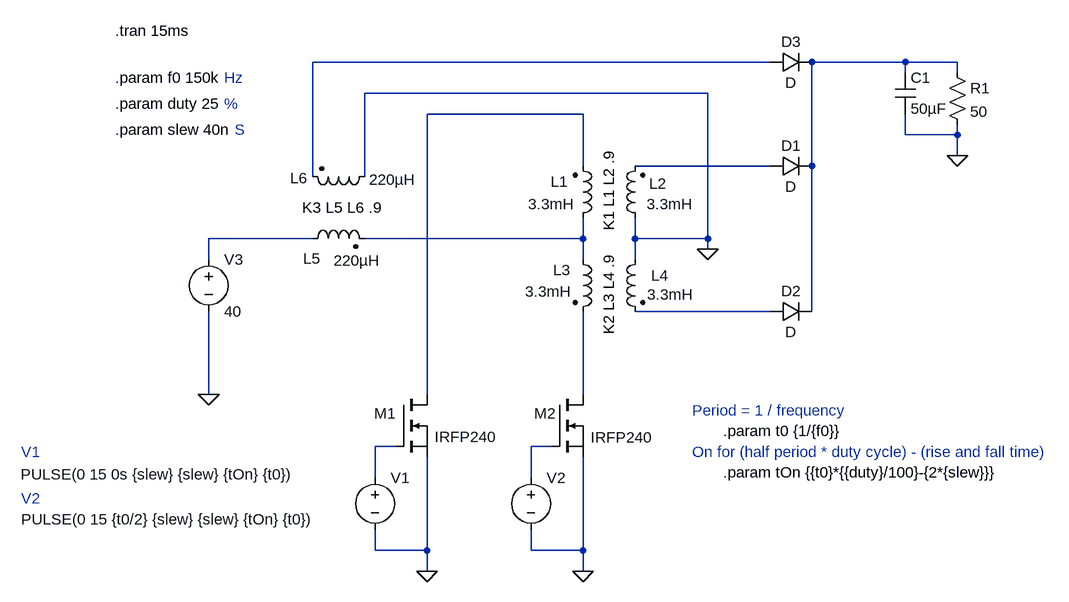
[diagram p0: schematic v03-NonIdeal.asc]
v03-NonIdeal.asc, the LTspice schematic file:
Version 4
SHEET 1 1008 1016
WIRE 448 32 -256 32
WIRE 656 32 512 32
WIRE 736 32 656 32
WIRE 656 48 656 32
WIRE 736 48 736 32
WIRE 352 80 -176 80
WIRE 160 112 -80 112
WIRE 656 144 656 112
WIRE 736 144 736 128
WIRE 736 144 656 144
WIRE 736 176 736 144
WIRE 160 192 160 112
WIRE 448 192 240 192
WIRE 512 192 512 32
WIRE -256 208 -256 32
WIRE -176 208 -176 80
WIRE -256 304 -416 304
WIRE 160 304 160 272
WIRE 160 304 -176 304
WIRE 240 304 240 272
WIRE 352 304 352 80
WIRE 352 304 240 304
WIRE 352 320 352 304
WIRE -416 336 -416 304
WIRE 160 336 160 304
WIRE 240 336 240 304
WIRE 448 416 240 416
WIRE 512 416 512 192
WIRE -416 544 -416 416
WIRE -80 544 -80 112
WIRE 160 544 160 416
WIRE -128 624 -160 624
WIRE 112 624 80 624
WIRE -160 672 -160 624
WIRE 80 672 80 624
WIRE -160 784 -160 752
WIRE -80 784 -80 640
WIRE -80 784 -160 784
WIRE 80 784 80 752
WIRE 160 784 160 640
WIRE 160 784 80 784
WIRE -80 816 -80 784
WIRE 160 816 160 784
FLAG -80 816 0
FLAG 160 816 0
FLAG 736 176 0
FLAG -416 544 0
FLAG 352 320 0
SYMBOL ind2 144 288 M180
WINDOW 0 -34 72 Left 2
WINDOW 3 -68 37 Left 2
SYMATTR InstName L1
SYMATTR Value 3.3mH
SYMATTR Type ind
SYMATTR SpiceLine Rser=0.32
SYMBOL ind2 256 288 R180
WINDOW 0 -33 69 Left 2
WINDOW 3 -73 37 Left 2
SYMATTR InstName L2
SYMATTR Value 3.3mH
SYMATTR Type ind
SYMATTR SpiceLine Rser=0.32
SYMBOL ind2 144 320 R0
WINDOW 0 -30 32 Left 2
WINDOW 3 -73 65 Left 2
SYMATTR InstName L3
SYMATTR Value 3.3mH
SYMATTR Type ind
SYMATTR SpiceLine Rser=0.32
SYMBOL ind2 256 320 M0
WINDOW 0 -36 41 Left 2
WINDOW 3 -74 70 Left 2
SYMATTR InstName L4
SYMATTR Value 3.3mH
SYMATTR Type ind
SYMATTR SpiceLine Rser=0.32
SYMBOL ind2 -272 320 R270
WINDOW 0 -30 15 VTop 2
WINDOW 3 -2 84 VBottom 2
SYMATTR InstName L5
SYMATTR Value 220µH
SYMATTR Type ind
SYMATTR SpiceLine Rser=0.32
SYMBOL ind2 -160 192 R90
WINDOW 0 34 117 VBottom 2
WINDOW 3 5 -27 VTop 2
SYMATTR InstName L6
SYMATTR Value 220µH
SYMATTR Type ind
SYMATTR SpiceLine Rser=0.32
SYMBOL nmos -128 544 R0
WINDOW 0 -33 29 Left 2
WINDOW 3 60 65 Left 2
SYMATTR InstName M1
SYMATTR Value IRFP240
SYMBOL nmos 112 544 R0
WINDOW 0 -27 29 Left 2
WINDOW 3 60 66 Left 2
SYMATTR InstName M2
SYMATTR Value IRFP240
SYMBOL diode 448 208 R270
WINDOW 0 32 32 VTop 2
WINDOW 3 0 32 VBottom 2
SYMATTR InstName D1
SYMBOL diode 448 432 R270
WINDOW 0 32 32 VTop 2
WINDOW 3 0 32 VBottom 2
SYMATTR InstName D2
SYMBOL diode 448 48 R270
WINDOW 0 32 32 VTop 2
WINDOW 3 0 32 VBottom 2
SYMATTR InstName D3
SYMBOL voltage -160 656 R0
WINDOW 3 -545 11 Left 2
WINDOW 123 0 0 Left 2
WINDOW 39 0 0 Left 2
SYMATTR Value PULSE(0 15 0s {slew} {slew} {tOn} {t0})
SYMATTR InstName V1
SYMBOL voltage 80 656 R0
WINDOW 123 0 0 Left 2
WINDOW 39 0 0 Left 2
WINDOW 3 -784 80 Left 2
SYMATTR Value PULSE(0 15 {t0/2} {slew} {slew} {tOn} {t0})
SYMATTR InstName V2
SYMBOL cap 640 48 R0
SYMATTR InstName C1
SYMATTR Value 50µF
SYMBOL res 720 32 R0
SYMATTR InstName R1
SYMATTR Value 50
SYMBOL voltage -416 320 R0
WINDOW 123 0 0 Left 2
WINDOW 39 0 0 Left 2
SYMATTR InstName V3
SYMATTR Value 40
TEXT 200 168 VRight 2 !K1 L1 L2 .9
TEXT 200 328 VRight 2 !K2 L3 L4 .9
TEXT -272 256 Left 2 !K3 L5 L6 .9
TEXT -560 -16 Left 2 !.tran 15ms
TEXT -560 96 Left 2 !.param duty 25
TEXT 376 664 Left 2 !.param tOn {{t0}*{{duty}/100}-{2*{slew}}}
TEXT -560 56 Left 2 !.param f0 150k
TEXT 376 600 Left 2 !.param t0 {1/{f0}}
TEXT -392 96 Left 2 ;%
TEXT -392 56 Left 2 ;Hz
TEXT 328 632 Left 2 ;On for (half period * duty cycle) - (rise and fall time)
TEXT 328 568 Left 2 ;Period = 1 / frequency
TEXT -560 136 Left 2 !.param slew 40n
TEXT -376 136 Left 2 ;S
TEXT -704 632 Left 2 ;V1
TEXT -704 704 Left 2 ;V2

The netlist it stands for:
* v03-NonIdeal.asc
L1 N006 N003 3.3mH Rser=0.32
L2 0 N004 3.3mH Rser=0.32
L3 N006 N008 3.3mH Rser=0.32
L4 0 N007 3.3mH Rser=0.32
L5 N005 N006 220µH Rser=0.32
L6 0 N001 220µH Rser=0.32
M1 N003 N009 0 0 IRFP240
M2 N008 N010 0 0 IRFP240
D1 N004 N002 D
D2 N007 N002 D
D3 N001 N002 D
V1 N009 0 PULSE(0 15 0s {slew} {slew} {tOn} {t0})
V2 N010 0 PULSE(0 15 {t0/2} {slew} {slew} {tOn} {t0})
C1 N002 0 50µF
R1 N002 0 50
V3 N005 0 40
.model D D
.lib standard.dio
.model NMOS NMOS
.model PMOS PMOS
.lib standard.mos
K1 L1 L2 .9
K2 L3 L4 .9
K3 L5 L6 .9
.tran 15ms
.param duty 25
.param tOn {{t0}*{{duty}/100}-{2*{slew}}}
.param f0 150k
.param t0 {1/{f0}}
* %
* Hz
* On for (half period * duty cycle) - (rise and fall time)
* Period = 1 / frequency
.param slew 40n
* S
* V1
* V2
.backanno
.end